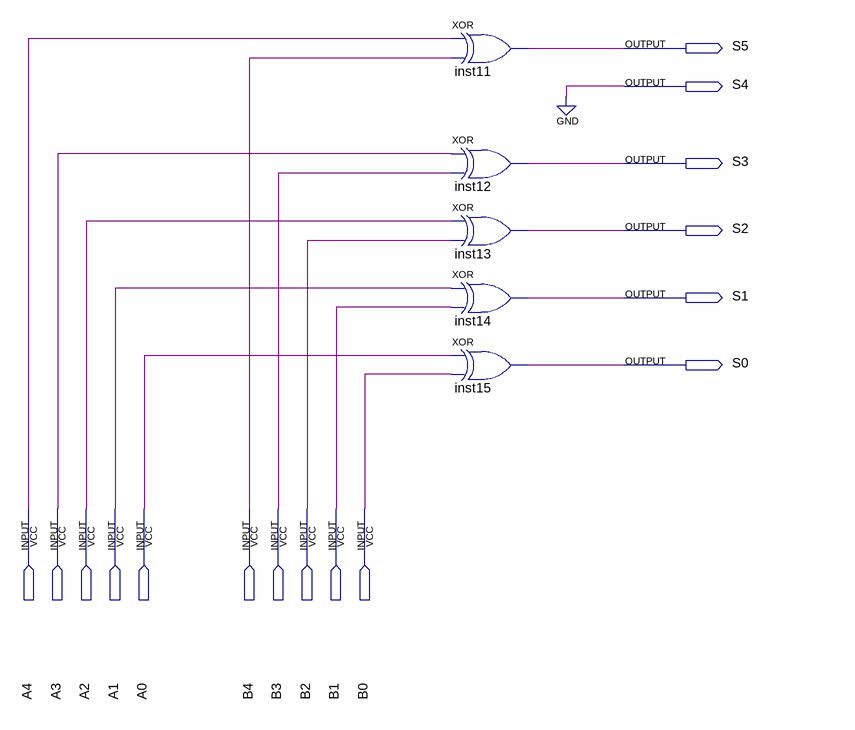
[diagram p0: schematic sheet]
// Quartus schematic axorb.bdf as structural Verilog: 5 symbols, 16 pins
module axorb (
  input  A4,
  input  A3,
  input  A2,
  input  A1,
  input  A0,
  input  B4,
  input  B3,
  input  B2,
  input  B1,
  input  B0,
  output S5,
  output S4,
  output S3,
  output S2,
  output S1,
  output S0
);

  xor inst11 (S5, A4, B4);
  xor inst12 (S3, A3, B3);
  xor inst13 (S2, A2, B2);
  xor inst14 (S1, A1, B1);
  xor inst15 (S0, A0, B0);

  assign S4 = 1'b0;
endmodule
